# Altium project altium_giris.PrjPcb (part 2 of 3)

## Sheet Microcontroller.SchDoc: Wireless Security Detector
size A3; Engineer: Hamit; DocumentNumber: 3; SheetNumber: 3; SheetTotal: 4
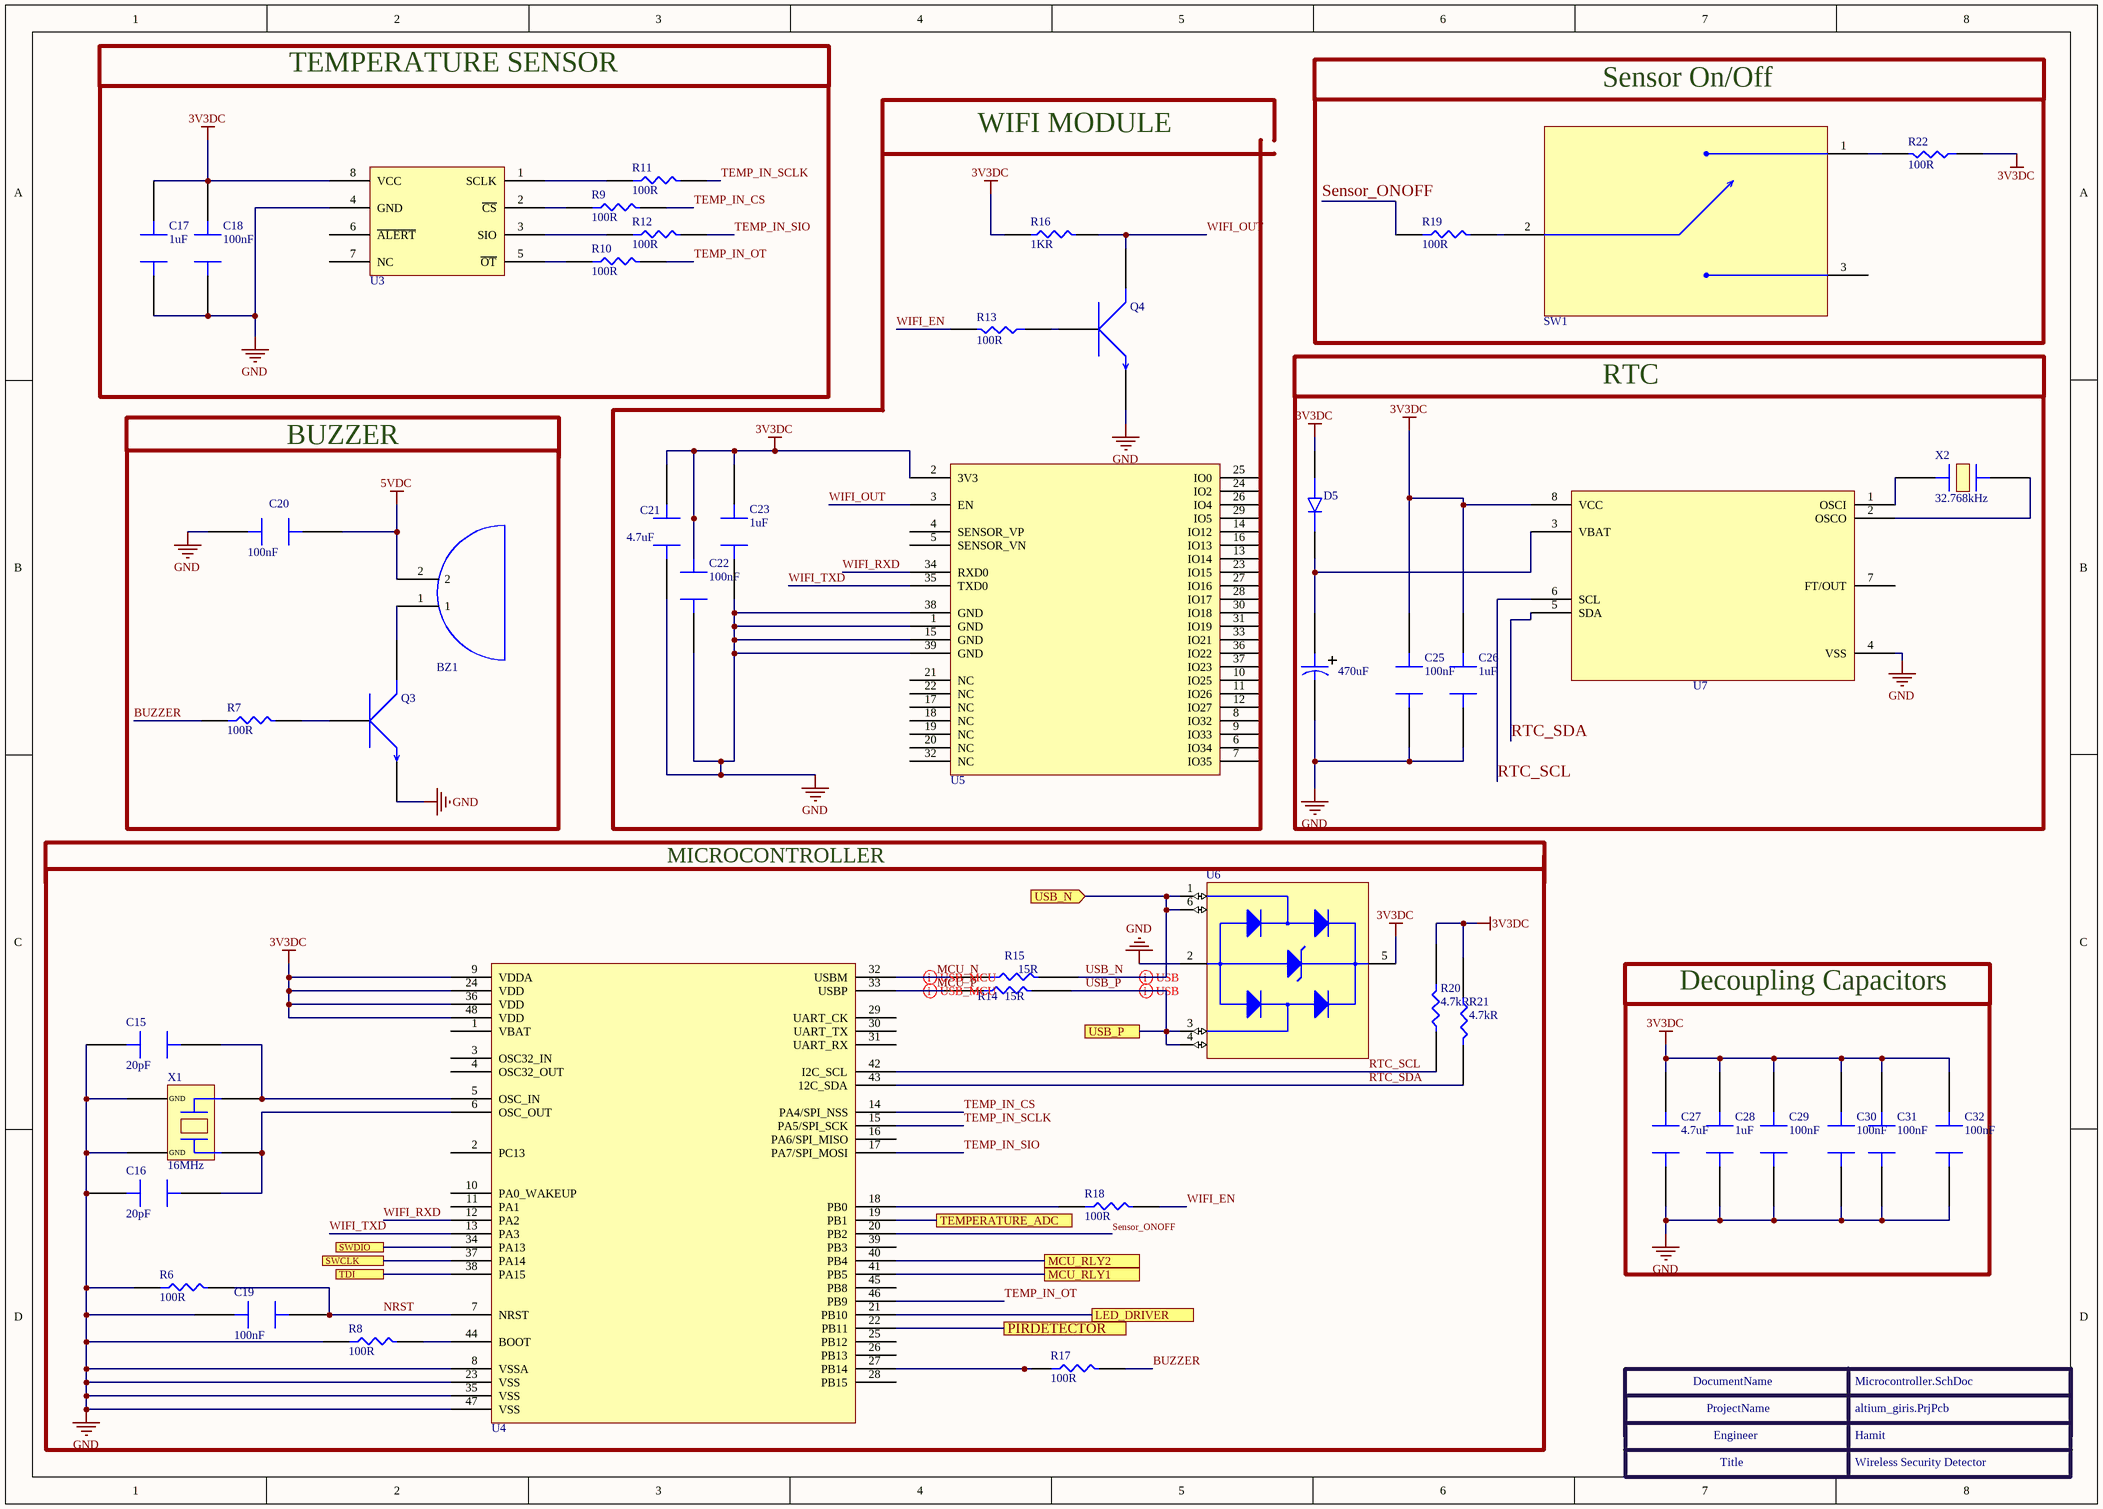
[diagram p5: Microcontroller.SchDoc]

### Parts
BZ1  CMI-9605IC-0580T  [CMI-9605IC-0580T]  (value not drawn)
C15  Capacitance: 20pF  [CAP_0603]  (hidden comment: CL10C200JB8NNNC)
C16  Capacitance: 20pF  [CAP_0603]  (hidden comment: CL10C200JB8NNNC)
C17  Capacitance: 1uF  [cap_0805]  (hidden comment: CAP CER 1uF 0805)
C18  Capacitance: 100nF  [cap_0805]  (hidden comment: CL21B104KBCNNNC)
C19  Capacitance: 100nF  [CAP_0603]  (hidden comment: CAP CER 100nF 0603)
C20  Capacitance: 100nF  [CAP_0603]  (hidden comment: CAP CER 100nF 0603)
C21  Capacitance: 4.7uF  [cap_0805]  (hidden comment: CL21A475KAQNNNE)
C22  Capacitance: 100nF  [cap_0805]  (hidden comment: CL21B104KBCNNNC)
C23  Capacitance: 1uF  [cap_0805]  (hidden comment: CAP CER 1uF 0805)
C24  Capacitance: 470uF  [cap_ESH477M050AH4AA]  (hidden comment: ESH477M050AH4AA)
C25  Capacitance: 100nF  [CAP_0603]  (hidden comment: CAP CER 100nF 0603)
C26  Capacitance: 1uF  [cap_0805]  (hidden comment: CAP CER 1uF 0805)
C27  Capacitance: 4.7uF  [cap_0805]  (hidden comment: CL21A475KAQNNNE)
C28  Capacitance: 1uF  [cap_0805]  (hidden comment: CAP CER 1uF 0805)
C29  Capacitance: 100nF  [CAP_0603]  (hidden comment: CAP CER 100nF 0603)
C30  Capacitance: 100nF  [CAP_0603]  (hidden comment: CAP CER 100nF 0603)
C31  Capacitance: 100nF  [CAP_0603]  (hidden comment: CAP CER 100nF 0603)
C32  Capacitance: 100nF  [CAP_0603]  (hidden comment: CAP CER 100nF 0603)
D5  DIODE GEN PURP 75V 150MA SOD323F  [1N4148WS]  (value not drawn)
Q3  MMBT3904-7-F  [SSM3K357R,LF]  (value not drawn)
Q4  MMBT3904-7-F  [SSM3K357R,LF]  (value not drawn)
R6  Resistance: 100R  [RES_0603]  (hidden comment: RC0603FR-7W100RL)
R7  Resistance: 100R  [RES_0603]  (hidden comment: RC0603FR-7W100RL)
R8  Resistance: 100R  [RES_0603]  (hidden comment: RC0603FR-7W100RL)
R9  Resistance: 100R  [RES_0603]  (hidden comment: RC0603FR-7W100RL)
R10  Resistance: 100R  [RES_0603]  (hidden comment: RC0603FR-7W100RL)
R11  Resistance: 100R  [RES_0603]  (hidden comment: RC0603FR-7W100RL)
R12  Resistance: 100R  [RES_0603]  (hidden comment: RC0603FR-7W100RL)
R13  Resistance: 100R  [RES_0603]  (hidden comment: RC0603FR-7W100RL)
R14  Resistance: 15R  [RES_0603]  (hidden comment: rc0603jr-0715rl)
R15  Resistance: 15R  [RES_0603]  (hidden comment: rc0603jr-0715rl)
R16  Resistance: 1KR  [RES_0603]  (hidden comment: RC0603FR-0710KL)
R17  Resistance: 100R  [RES_0603]  (hidden comment: RC0603FR-7W100RL)
R18  Resistance: 100R  [RES_0603]  (hidden comment: RC0603FR-7W100RL)
R19  Resistance: 100R  [RES_0603]  (hidden comment: RC0603FR-7W100RL)
R20  Resistance: 4.7kR  [RES_0603]  (hidden comment: RC0603JR-074K7L)
R21  Resistance: 4.7kR  [RES_0603]  (hidden comment: RC0603JR-074K7L)
R22  Resistance: 100R  [RES_0603]  (hidden comment: RC0603FR-7W100RL)
SW1  EG1215AA  [EG1215AA]  (value not drawn)
U3  MAX6662MSA+-ND  [LM2675MX-12/NOPB]  (value not drawn)
U4  STM32F103C6T7A  [LQFP-48]  (value not drawn)
U5  ESP32-WROOM-32E(4MB)  [ESP32-32]  (value not drawn)
U6  USBLC6-2SC6  [SOT23-6]  (value not drawn)
U7  M41T00M6F  [LM2675MX-12/NOPB]  (value not drawn)
X1  Frequency: 16MHz  [CRYSTAL_ECS-160-20-30B-TR]  (hidden comment: ECS-160-20-30B-TR)
X2  Frequency: 32.768kHz  [ABS05_crystal]  (hidden comment: ABS05-32.768KHZ-T)

### Blocks framed on the sheet
TEMPERATURE SENSOR: C17 C18 R9-R12 U3
Sensor On/Off: R19 R22 SW1
BUZZER: BZ1 C20 Q3 R7
RTC: C24-C26 D5 U7 X2
Decoupling Capacitors: C27-C32

### Ports
LED_DRIVER, MCU_RLY1, MCU_RLY2, PIRDETECTOR, SWCLK, SWDIO, TDI, TEMPERATURE_ADC, USB_N (in), USB_P

### Nets
3V3DC: C17.2 C18.2 C21.2 C22.2 C23.2 C25.2 C26.2 C27.2 C28.2 C29.2 C30.2 C31.2 C32.2 D5.A R16.2 R20.2 R21.1 R22.1 U3.8(VCC) U4.9(VDDA) U4.24(VDD) U4.36(VDD) U4.48(VDD) U5.2(3V3) U6.5(VBUS) U7.8(VCC)
5VDC: BZ1.2 C20.2
GND: C15.2 C16.2 C17.1 C18.1 C19.2 C20.1 C21.1 C22.1 C23.1 C24.2 C25.1 C26.1 C27.1 C28.1 C29.1 C30.1 C31.1 C32.1 Q3.2(E) Q4.2(E) R6.1 R8.1 U3.4(GND) U4.8(VSSA) U4.23(VSS) U4.35(VSS) U4.47(VSS) U5.1(GND) U5.15(GND) U5.38(GND) U5.39(GND) U6.2(GND) U7.4(VSS) X1.2(GND) X1.4(GND)
BUZZER: R7.1 R17.2
MCU_N: R15.1 U4.32(USBM)
MCU_P: R14.1 U4.33(USBP)
NRST: C19.1 R6.2 U4.7(NRST)
RTC_SCL: R20.1 U4.42(I2C_SCL) U7.6(SCL)
RTC_SDA: R21.2 U4.43(12C_SDA) U7.5(SDA)
Sensor_ONOFF: R19.1 U4.20(PB2)
TEMP_IN_CS: R9.2 U4.14(PA4/SPI_NSS)
TEMP_IN_OT: R10.2 U4.46(PB9)
TEMP_IN_SCLK: R11.2 U4.15(PA5/SPI_SCK)
TEMP_IN_SIO: R12.2 U4.17(PA7/SPI_MOSI)
USB_N: R15.2 U6.1(I/O1) U6.6(I/O1) ; port USB_N
USB_P: R14.2 U6.3(I/O2) U6.4(I/O2) ; port USB_P
WIFI_EN: R13.2 R18.2
WIFI_OUT: Q4.3(C) R16.1 U5.3(EN)
WIFI_RXD: U4.12(PA2) U5.34(RXD0)
WIFI_TXD: U4.13(PA3) U5.35(TXD0)
NetBZ1_1: BZ1.1 Q3.3(C)
NetC15_1: C15.1 U4.5(OSC_IN) X1.3
NetC16_1: C16.1 U4.6(OSC_OUT) X1.1
NetC24_1: C24.1 D5.C U7.3(VBAT)
NetJ5_3: U4.19(PB1) ; port TEMPERATURE_ADC
NetJ5_4: U4.21(PB10) ; port LED_DRIVER
NetJ5_5: U4.22(PB11) ; port PIRDETECTOR
NetJ7_2: U4.34(PA13) ; port SWDIO
NetJ7_3: U4.37(PA14) ; port SWCLK
NetJ7_4: U4.38(PA15) ; port TDI
NetQ3_1: Q3.1(B) R7.2
NetQ4_1: Q4.1(B) R13.1
NetR2_1: U4.41(PB5) ; port MCU_RLY1
NetR4_1: U4.40(PB4) ; port MCU_RLY2
NetR8_2: R8.2 U4.44(BOOT)
NetR9_1: R9.1 U3.2(~{CS})
NetR10_1: R10.1 U3.5(~{OT})
NetR11_1: R11.1 U3.1(SCLK)
NetR12_1: R12.1 U3.3(SIO)
NetR17_1: R17.1 U4.27(PB14)
NetR18_1: R18.1 U4.18(PB0)
NetR19_2: R19.2 SW1.2
NetR22_2: R22.2 SW1.1
NetU7_1: U7.1(OSCI) X2.1
NetU7_2: U7.2(OSCO) X2.2

Not connected (* = marked no-connect by the designer): SW1 3; U3 6(~{ALERT}) 7(NC); U4 1(VBAT) 2(PC13) 3(OSC32_IN) 4(OSC32_OUT) 10(PA0_WAKEUP) 11(PA1) 16(PA6/SPI_MISO) 25(PB12) 26(PB13) 28(PB15) 29(UART_CK) 30(UART_TX) 31(UART_RX) 39(PB3) 45(PB8); U5 4(SENSOR_VP) 5(SENSOR_VN) 6(IO34) 7(IO35) 8(IO32) 9(IO33) 10(IO25) 11(IO26) 12(IO27) 13(IO14) 14(IO12) 16(IO13) 17(NC) 18(NC) 19(NC) 20(NC) 21(NC) 22(NC) 23(IO15) 24(IO2) 25(IO0) 26(IO4) 27(IO16) 28(IO17) 29(IO5) 30(IO18) 31(IO19) 32(NC) 33(IO21) 36(IO22) 37(IO23); U7 7(FT/OUT)

### Layout directives
differential pair: MCU_N, MCU_P, USB_N, USB_P

### Notes on the sheet
- WIFI MODULE
- MICROCONTROLLER
- DocumentName
- ProjectName
- Engineer
- Title

### Library data of the parts
BZ1 = CMI-9605IC-0580T: Buzzers Indicator, Internally Driven Magnetic 30mA 2.7kHz 80dB @ 5V, 10cm Through Hole PC Pins; Manufacturer: CUI Devices; Designed by: Hamit; Supplier 1: Digi-Key; Manufacturer Part Number: CMI-9605IC-0580T; RoHS: No; Stock 1: 1402; Pricing 1: 1=1,56000, 10=1,17900, 25=1,09080, 50=1,02680, 100=0,96490, 500=0,83018, 1000=0,77805 (USD); Supplier Part Number 1: 2223-CMI-9605IC-0580T-ND
C15 C16 = CAP CER 20PF: SAMSUNG ELECTRO-MECHANICS - CL10C200JB8NNNC - SMD Multilayer Ceramic Capacitor, 20 pF, 50 V, 0603 [1608 Metric], ± 5%, C0G / NP0, CL Series; Voltage Rating: 50V; Temperature Coefficient: 300ppm/°C; Designed by: Hamit; Supplier 1: Digi-Key; Manufacturer: Samsung; Manufacturer Part Number: CL10C200JB8NNNC; RoHS: Yes; Category: Ceramic Capacitors; Stock 1: 540004; Pricing 1: 1=0,10000, 10=0,04900, 50=0,02680, 100=0,02180, 500=0,01558, 1000=0,01224 (USD); Mount: Surface Mount; Case/Package: 0603; Case Code (Metric): 1608; Case Code (Imperial): 0603; Min Operating Temperature: -55°C; Max Operating Temperature: 125°C; Tolerance: 5%; Dielectric: C0G; Package Quantity: 1; Packaging: Tape and Reel; Voltage: 50V; Series: CL; Construction: Flat; Length: 1.6mm; Width: 0.031inch; Height: 0.8mm; Thickness: 0.035inch; Depth: 0.8mm; Radiation Hardening: No; RoHS Compliant: Yes; ComponentLink1URL: https://datasheet.ciiva.com/26877/getdatasheetpartid-640634-26877974.pdf?src-supplier=Verical; ComponentLink1Description: https://datasheet.ciiva.com/26877/getdatasheetpartid-640634-26877974.pdf?src-supplier=Verical; ComponentLink2URL: https://datasheet.ciiva.com/26310/mlcc-catalogdownload2013-eng-26310315.pdf?src-supplier=Distrelec; ComponentLink2Description: https://datasheet.ciiva.com/26310/mlcc-catalogdownload2013-eng-26310315.pdf?src-supplier=Distrelec; Supplier Part Number 1: 1276-1187-1-ND
C17 C23 C26 C28 = CAP CER 1uF 0805: 0805 0.1 uF ±10 % Tolerance 50 V X7R Multilayer Ceramic Capacitors; Manufacturer: Samsung; Manufacturer Part Number: CL21B104KBFNNNE; Designed by: Hamit; Tolerance: 10%; Voltage Rating: 50V; Supplier 1: Digi-Key; RoHS: Yes; Category: Ceramic Capacitors; Pricing 1: 1=0,10000, 10=0,04900, 50=0,02700, 100=0,02200, 500=0,01574, 1000=0,01237 (USD); Mount: Surface Mount; Case/Package: 0805; Case Code (Metric): 2012; Case Code (Imperial): 0805; Contact Plating: Tin; Min Operating Temperature: -55°C; Max Operating Temperature: 125°C; Dielectric: X7R; Package Quantity: 1; Packaging: Tape and Reel; Voltage Rating (DC): 50V; Series: CL; Construction: Flat; Length: 2mm; Width: 0.049inch; Height: 1.25mm; Thickness: 0.053inch; Depth: 1.25mm; Radiation Hardening: No; Lead Free: Lead Free; RoHS Compliant: Yes; ComponentLink1URL: https://datasheet.ciiva.com/25736/cl21b104kbfnnne-25736721.pdf?src-supplier=Digi-Key; ComponentLink1Description: https://datasheet.ciiva.com/25736/cl21b104kbfnnne-25736721.pdf?src-supplier=Digi-Key; Supplier Part Number 1: 1276-1180-1-ND
C18 C22 = CAP cer 100nF 0805: Samsung Electro-Mechanics 100nF Multilayer Ceramic Capacitor (MLCC) 50 V 10% X7R dielectric CL max op. temp. +125C; Designed by: Hamit; Voltage Rating: 50V; Supplier 1: Digi-Key; Manufacturer: Samsung; Manufacturer Part Number: CL21B104KBCNNNC; RoHS: Yes; Category: Ceramic Capacitors; Pricing 1: 1=0,10000, 10=0,05000, 50=0,02740, 100=0,02240, 500=0,01598, 1000=0,01256 (USD); Mount: Surface Mount; Case/Package: 0805; Case Code (Metric): 2012; Case Code (Imperial): 0805; Material: Ceramic; Contact Plating: Tin; Min Operating Temperature: -55°C; Max Operating Temperature: 125°C; Tolerance: 10%; Dielectric: X7R; Packaging: Tape and Reel; Voltage: 50V; Voltage Rating (DC): 50V; Series: CL; Construction: Flat; Length: 2mm; Width: 0.049inch; Height: 0.85mm; Depth: 1.25mm; Thickness: 0.037inch; Radiation Hardening: No; Lead Free: Lead Free; RoHS Compliant: Yes; ComponentLink1URL: https://datasheet.ciiva.com/25710/cl21b104kbcnnnc-25710182.pdf?src-supplier=Digi-Key; ComponentLink1Description: https://datasheet.ciiva.com/25710/cl21b104kbcnnnc-25710182.pdf?src-supplier=Digi-Key; ComponentLink2URL: https://datasheet.ciiva.com/29199/454152-da-01-en-vs-kondensator-0805-29199814.pdf?src-supplier=Conrad; ComponentLink2Description: https://datasheet.ciiva.com/29199/454152-da-01-en-vs-kondensator-0805-29199814.pdf?src-supplier=Conrad; Supplier Part Number 1: 1276-1003-1-ND
C19 C20 C25 C29-C32 = CAP CER 100nF 0603: KEMET - C0603C104K5RACTU - SMD Multilayer Ceramic Capacitor, 0.1 µF, 50 V, 0603 [1608 Metric], ± 10%, X7R, C Series KEMET; Designed by: Hamit; Voltage Rating (DC): 50V; Dissipation Factor: 2.5%; Supplier 1: Digi-Key; Manufacturer: KEMET; Manufacturer Part Number: C0603C104K5RACTU; RoHS: Yes; Category: Ceramic Capacitors; Stock 1: 4486940; Pricing 1: 1=0,12000, 10=0,08900, 50=0,04840, 100=0,03940, 500=0,02818, 1000=0,02214 (USD); Mount: Surface Mount; Case/Package: 0603; Number of Pins: 2; Case Code (Metric): 1608; Case Code (Imperial): 0603; Dielectric Material: Ceramic; Contact Plating: Tin,Matte; Min Operating Temperature: -55°C; Max Operating Temperature: 125°C; Tolerance: 10%; Packaging: Tape and Reel; Package Quantity: 1; Dielectric: X7R; Termination: SMD/SMT; Voltage: 50V; Voltage Rating: 50V; Series: SMD Comm X7R; Length: 0.063inch; Width: 0.031inch; Height: 0.8mm; Thickness: 0.034inch; Lead Pitch: 0.7mm; Depth: 0.8mm; Radiation Hardening: No; RoHS Compliant: Yes; REACH SVHC: No SVHC; ComponentLink1URL: https://datasheet.ciiva.com/7823/kem-c1002-x7r-smd-7823591.pdf?src-supplier=Element14; ComponentLink1Description: https://datasheet.ciiva.com/7823/kem-c1002-x7r-smd-7823591.pdf?src-supplier=Element14; ComponentLink2URL: https://datasheet.ciiva.com/14602/70095383-14602583.pdf?src-supplier=Allied+Electronics; ComponentLink2Description: https://datasheet.ciiva.com/14602/70095383-14602583.pdf?src-supplier=Allied+Electronics; ComponentLink3URL: https://datasheet.ciiva.com/5999/kem-c1002-x7r-smd-5999400.pdf?src-supplier=Farnell; ComponentLink3Description: https://datasheet.ciiva.com/5999/kem-c1002-x7r-smd-5999400.pdf?src-supplier=Farnell; ComponentLink4URL: https://datasheet.ciiva.com/7823/kem-c1002-x7r-smd-7823592.pdf?src-supplier=Element14; ComponentLink4Description: https://datasheet.ciiva.com/7823/kem-c1002-x7r-smd-7823592.pdf?src-supplier=Element14; ComponentLink5URL: https://datasheet.ciiva.com/28645/1851736-28645640.pdf?src-supplier=Element14; ComponentLink5Description: https://datasheet.ciiva.com/28645/1851736-28645640.pdf?src-supplier=Element14; ComponentLink6URL: https://datasheet.ciiva.com/14585/70095383-14585209.pdf?src-supplier=Allied+Electronics; ComponentLink6Description: https://datasheet.ciiva.com/14585/70095383-14585209.pdf?src-supplier=Allied+Electronics; Supplier Part Number 1: 399-5089-6-ND
C21 = cap_0805_4.7uF: SAMSUNG ELECTRO-MECHANICS - CL21A475KAQNNNE - SMD Multilayer Ceramic Capacitor, 4.7 µF, 25 V, 0805 [2012 Metric], ± 10%, X5R, CL Series; Voltage Rating: 25V; Designed by: Hamit; Supplier 1: Mouser; Manufacturer: Samsung; Manufacturer Part Number: CL21A475KAQNNNE; RoHS: Yes; Category: Ceramic Capacitors; Stock 1: 975; Pricing 1: 1=0,12000, 10=0,04800, 50=0,04800, 100=0,03900, 500=0,02800, 1000=0,02300, 2000=0,02000, 10000=0,02000 (USD); Mount: Surface Mount; Case/Package: 0805; Case Code (Metric): 2012; Case Code (Imperial): 0805; Min Operating Temperature: -55°C; Max Operating Temperature: 85°C; Package Quantity: 1; Packaging: Tape and Reel; Tolerance: 10%; Dielectric: X5R; Voltage Rating (DC): 25V; Series: CL; Construction: Flat; Length: 2mm; Width: 0.049inch; Height: 1.25mm; Thickness: 0.055inch; Depth: 1.25mm; Radiation Hardening: No; Lead Free: Lead Free; RoHS Compliant: Yes; ComponentLink1URL: https://datasheet.ciiva.com/25798/cl21a475kaqnnne-25798882.pdf?src-supplier=Digi-Key; ComponentLink1Description: https://datasheet.ciiva.com/25798/cl21a475kaqnnne-25798882.pdf?src-supplier=Digi-Key; Supplier Part Number 1: 187-CL21A475KAQNNNE
C24 = CAP ALU 470uF: Cap, 470UF, 50V, Alu Elec, Radial; Manufacturer: KEMET; Designed by: Hamit; Polarity: Polar; Tolerance: 20%; Life (Hours): 2000Hour; Supplier 1: Digi-Key; Manufacturer Part Number: ESH477M050AH4AA; RoHS: Yes; Pricing 1: 1=0,59000, 10=0,41700, 50=0,31540, 100=0,27470, 500=0,20350, 1000=0,17298, 2500=0,16280, 5000=0,15262 (USD); Mount: Through Hole; Case/Package: Radial; Min Operating Temperature: -40°C; Max Operating Temperature: 105°C; Packaging: Bulk; Voltage Rating: 50V; RoHS Compliant: No; ComponentLink1URL: https://api.kemet.com/component-edge/download/datasheet/ESH477M050AH4AA.pdf?src-supplier=Digi-Key; ComponentLink1Description: https://api.kemet.com/component-edge/download/datasheet/ESH477M050AH4AA.pdf?src-supplier=Digi-Key; Supplier Part Number 1: 399-15683-ND
C27 = CAP CER 4.7 uF: SAMSUNG ELECTRO-MECHANICS - CL21A475KAQNNNE - SMD Multilayer Ceramic Capacitor, 4.7 µF, 25 V, 0805 [2012 Metric], ± 10%, X5R, CL Series; Voltage Rating: 25V; Designed by: Hamit; Supplier 1: Digi-Key; Manufacturer: Samsung; Manufacturer Part Number: CL21A475KAQNNNE; RoHS: Yes; Category: Ceramic Capacitors; Pricing 1: 1=0,12000, 10=0,08300, 50=0,04700, 100=0,03890, 500=0,02728, 1000=0,02259 (USD); Mount: Surface Mount; Case/Package: 0805; Case Code (Metric): 2012; Case Code (Imperial): 0805; Min Operating Temperature: -55°C; Max Operating Temperature: 85°C; Package Quantity: 1; Packaging: Tape and Reel; Tolerance: 10%; Dielectric: X5R; Voltage Rating (DC): 25V; Series: CL; Construction: Flat; Length: 2mm; Width: 0.049inch; Height: 1.25mm; Thickness: 0.055inch; Depth: 1.25mm; Radiation Hardening: No; Lead Free: Lead Free; RoHS Compliant: Yes; ComponentLink1URL: https://datasheet.ciiva.com/25798/cl21a475kaqnnne-25798882.pdf?src-supplier=Digi-Key; ComponentLink1Description: https://datasheet.ciiva.com/25798/cl21a475kaqnnne-25798882.pdf?src-supplier=Digi-Key; Supplier Part Number 1: 1276-1244-1-ND
D5 = 1N4148WS: ON SEMICONDUCTOR - 1N4148WS - Small Signal Diode, Single, 75 V, 150 mA, 1 V, 4 ns; Manufacturer: ON Semiconductor / Fairchild; Designed by: Hamit; Reverse Recovery Time: 4ns; Forward Voltage: 1V; Max Reverse Current: 5uA; Power Dissipation: 200mW; Max Forward Surge Current (Ifsm): 2A; Supplier 1: Digi-Key; Manufacturer Part Number: 1N4148WS; RoHS: Yes; Category: Rectifier Diodes; Pricing 1: 1=0,21000, 10=0,19200, 100=0,10460, 500=0,06436, 1000=0,04388 (USD); Mount: Surface Mount; Number of Pins: 2; Contact Plating: Tin,Matte; Weight: 0.0276g; Min Operating Temperature: -55°C; Max Operating Temperature: 150°C; Packaging: Tape and Reel; Forward Current: 150mA; Max Repetitive Reverse Voltage (Vrrm): 75V; Element Configuration: Single; Package Quantity: 1; Average Rectified Current: 150mA; Max Reverse Voltage (DC): 75V; Recovery Time: 4ns; Series: -; Reverse Voltage: 75V; Length: 1.8mm; Width: 1.35mm; Height: 1mm; Radiation Hardening: No; RoHS Compliant: Yes; REACH SVHC: No SVHC; Lead Free: Lead Free; ComponentLink1URL: https://datasheet.ciiva.com/25968/1n914bws-25968945.pdf?src-supplier=Avnet+Europe; ComponentLink1Description: https://datasheet.ciiva.com/25968/1n914bws-25968945.pdf?src-supplier=Avnet+Europe; ComponentLink2URL: https://datasheet.ciiva.com/30479/0900766b810e1cd3-30479206.pdf?src-supplier=RSComponents; ComponentLink2Description: https://datasheet.ciiva.com/30479/0900766b810e1cd3-30479206.pdf?src-supplier=RSComponents; ComponentLink3URL: https://datasheet.ciiva.com/8300/1n914bws-8300360.pdf?src-supplier=Avnet; ComponentLink3Description: https://datasheet.ciiva.com/8300/1n914bws-8300360.pdf?src-supplier=Avnet; ComponentLink4URL: https://datasheet.ciiva.com/15208/getdatasheetpartid-127819-15208358.pdf?src-supplier=Verical; ComponentLink4Description: https://datasheet.ciiva.com/15208/getdatasheetpartid-127819-15208358.pdf?src-supplier=Verical; ComponentLink5URL: https://datasheet.ciiva.com/910/1n4148ws-910381.pdf?src-supplier=Digi-Key; ComponentLink5Description: https://datasheet.ciiva.com/910/1n4148ws-910381.pdf?src-supplier=Digi-Key; ComponentLink6URL: https://datasheet.ciiva.com/910/1n4148ws-910382.pdf?src-supplier=Digi-Key; ComponentLink6Description: https://datasheet.ciiva.com/910/1n4148ws-910382.pdf?src-supplier=Digi-Key; ComponentLink7URL: https://datasheet.ciiva.com/910/1n4148ws-910380.pdf?src-supplier=Digi-Key; ComponentLink7Description: https://datasheet.ciiva.com/910/1n4148ws-910380.pdf?src-supplier=Digi-Key; Supplier Part Number 1: 1N4148WSFSCT-ND
Q3 Q4 = MMBT3904-7-F: Transistor General Purpose BJT NPN 40 Volt 0.2A Automotive 3-Pin SOT-23; Manufacturer: Diodes Zetex; Designed by: Hamit; Max Power Dissipation: 300mW; Collector Emitter Voltage (VCEO): 40V; Max Collector Current: 200mA; Collector Base Voltage (VCBO): 60V; Frequency: 300MHz; hFE Min: 100; Number of Elements: 1; Emitter Base Voltage (VEBO): 6V; Collector Emitter Saturation Voltage: 300mV; Power Dissipation: 350mW; Element Configuration: Single; Supplier 1: Digi-Key; Manufacturer Part Number: MMBT3904-7-F; RoHS: Yes; Category: BJTs; Pricing 1: 1=0,12000, 10=0,11100, 25=0,10600, 100=0,06060, 500=0,03732, 1000=0,02544 (USD); Mount: Surface Mount; Case/Package: SOT-23; Number of Pins: 3; Weight: 0.000282oz; Contact Plating: Tin,Matte; Min Operating Temperature: -55°C; Max Operating Temperature: 150°C; Polarity: NPN; Packaging: Tape and Reel; Package Quantity: 3000; Transition Frequency: 300MHz; Collector Emitter Breakdown Voltage: 40V; Max Breakdown Voltage: 40V; Continuous Collector Current: 200mA; Max Frequency: 300MHz; Gain Bandwidth Product: 300MHz; Series: -; Collector-emitter Voltage-Max: 300mV; Voltage Rating (DC): 40V; Length: 3.05mm; Width: 1.4mm; Height: 1mm; Radiation Hardening: No; REACH SVHC: No SVHC; Lead Free: Lead Free; RoHS Compliant: Yes; ComponentLink1URL: https://datasheet.ciiva.com/11201/ds30036-11201778.pdf?src-supplier=Avnet; ComponentLink1Description: https://datasheet.ciiva.com/11201/ds30036-11201778.pdf?src-supplier=Avnet; ComponentLink2URL: https://datasheet.ciiva.com/15138/getdatasheetpartid-53265-15138780.pdf?src-supplier=Verical; ComponentLink2Description: https://datasheet.ciiva.com/15138/getdatasheetpartid-53265-15138780.pdf?src-supplier=Verical; ComponentLink3URL: https://datasheet.ciiva.com/6361/ds30036-6361254.pdf?src-supplier=Digi-Key; ComponentLink3Description: https://datasheet.ciiva.com/6361/ds30036-6361254.pdf?src-supplier=Digi-Key; ComponentLink4URL: https://datasheet.ciiva.com/22711/1915516-22711750.pdf?src-supplier=Element14; ComponentLink4Description: https://datasheet.ciiva.com/22711/1915516-22711750.pdf?src-supplier=Element14; ComponentLink5URL: https://datasheet.ciiva.com/11198/ds30036-11198999.pdf?src-supplier=Avnet; ComponentLink5Description: https://datasheet.ciiva.com/11198/ds30036-11198999.pdf?src-supplier=Avnet; ComponentLink6URL: https://datasheet.ciiva.com/6361/ds30036-6361256.pdf?src-supplier=Digi-Key; ComponentLink6Description: https://datasheet.ciiva.com/6361/ds30036-6361256.pdf?src-supplier=Digi-Key; Supplier Part Number 1: MMBT3904-FDICT-ND
R6 R8 R13 = RES 100 OHm: RESISTOR, 0603, 100R, 1%; Manufacturer: Yageo; Voltage Rating: 50V; Power Rating: 100mW; Temperature Coefficient: 100ppm/°C; Supplier 1: Digi-Key; Manufacturer Part Number: RC0603FR-7W100RL; RoHS: Yes; Category: Chip SMD Resistors; Stock 1: 137; Pricing 1: 1=0,10000, 10=0,03600, 100=0,01450, 1000=0,00652, 2500=0,00566 (USD); Case/Package: 0603; Number of Pins: 2; Case Code (Metric): 1608; Case Code (Imperial): 0603; Packaging: Cut Tape; Tolerance: 1%; Resistor Type: Thick Film; Voltage Rating (DC): 50V; Resistance Tolerance: 1%; Series: RC0603; REACH SVHC: Unknown; RoHS Compliant: Yes; ComponentLink1URL: https://datasheet.ciiva.com/22704/1675737-22704044.pdf?src-supplier=Element14; ComponentLink1Description: https://datasheet.ciiva.com/22704/1675737-22704044.pdf?src-supplier=Element14; ComponentLink2URL: https://datasheet.ciiva.com/7746/1675737-7746414.pdf?src-supplier=Element14; ComponentLink2Description: https://datasheet.ciiva.com/7746/1675737-7746414.pdf?src-supplier=Element14; Supplier Part Number 1: 13-RC0603FR-7W100RLCT-ND
R7 R9-R12 R17-R19 R22 = RES 100 OHM: RESISTOR, 0603, 100R, 1%; Manufacturer: Yageo; Voltage Rating: 50V; Power Rating: 100mW; Temperature Coefficient: 100ppm/°C; Supplier 1: Digi-Key; Manufacturer Part Number: RC0603FR-7W100RL; RoHS: Yes; Category: Chip SMD Resistors; Stock 1: 137; Pricing 1: 1=0,10000, 10=0,03600, 100=0,01450, 1000=0,00652, 2500=0,00566 (USD); Case/Package: 0603; Number of Pins: 2; Case Code (Metric): 1608; Case Code (Imperial): 0603; Packaging: Cut Tape; Tolerance: 1%; Resistor Type: Thick Film; Voltage Rating (DC): 50V; Resistance Tolerance: 1%; Series: RC0603; REACH SVHC: Unknown; RoHS Compliant: Yes; ComponentLink1URL: https://datasheet.ciiva.com/22704/1675737-22704044.pdf?src-supplier=Element14; ComponentLink1Description: https://datasheet.ciiva.com/22704/1675737-22704044.pdf?src-supplier=Element14; ComponentLink2URL: https://datasheet.ciiva.com/7746/1675737-7746414.pdf?src-supplier=Element14; ComponentLink2Description: https://datasheet.ciiva.com/7746/1675737-7746414.pdf?src-supplier=Element14; Supplier Part Number 1: 13-RC0603FR-7W100RLCT-ND
R14 R15 = RES 15 OHM 0603: YAGEO - RC0603JR-0715RL - SMD Chip Resistor, 0603 [1608 Metric], 15 ohm, RC Series, 75 V, Thick Film, 100 mW; Designed by: Hamit; Tolerance: 5%; Temperature Coefficient: 100ppm/°C; Voltage Rating (DC): 50V; Power Rating: 100mW; Voltage Rating: 75V; Supplier 1: Digi-Key; Manufacturer: Yageo; Manufacturer Part Number: RC0603JR-0715RL; RoHS: Yes; Category: Chip SMD Resistors; Stock 1: 471705; Pricing 1: 1=0,10000, 10=0,02000, 100=0,00800, 1000=0,00360, 2500=0,00312 (USD); Case/Package: 0603; Number of Pins: 2; Case Code (Imperial): 0603; Case Code (Metric): 1608; Weight: 7.1E-05oz; Min Operating Temperature: -55°C; Max Operating Temperature: 155°C; Resistor Type: Thick Film; Packaging: Tape and Reel; Package Quantity: 1; Termination: SMD/SMT; Number of Terminations: 2; Max Power Dissipation: 100mW; Working Voltage: 75V; Features: Moisture Resistant; Series: RC; Resistance Tolerance: 5%; Construction: Rectangular; Length: 1.6mm; Width: 0.8mm; Height: 0.022inch; Depth: 0.8mm; REACH SVHC: No SVHC; Lead Free: Lead Free; Military Standard: Not; RoHS Compliant: Yes; ComponentLink1URL: https://datasheet.ciiva.com/2453/pyu-r-int-thick-7-2453085.pdf?src-supplier=Digi-Key; ComponentLink1Description: https://datasheet.ciiva.com/2453/pyu-r-int-thick-7-2453085.pdf?src-supplier=Digi-Key; ComponentLink2URL: https://datasheet.ciiva.com/7746/443971-7746445.pdf?src-supplier=Element14; ComponentLink2Description: https://datasheet.ciiva.com/7746/443971-7746445.pdf?src-supplier=Element14; ComponentLink3URL: https://datasheet.ciiva.com/2453/pyu-r-int-thick-7-2453086.pdf?src-supplier=Digi-Key; ComponentLink3Description: https://datasheet.ciiva.com/2453/pyu-r-int-thick-7-2453086.pdf?src-supplier=Digi-Key; ComponentLink4URL: https://datasheet.ciiva.com/7746/443971-7746446.pdf?src-supplier=Element14; ComponentLink4Description: https://datasheet.ciiva.com/7746/443971-7746446.pdf?src-supplier=Element14; ComponentLink5URL: https://datasheet.ciiva.com/2453/pyu-r-int-thick-7-2453087.pdf?src-supplier=Digi-Key; ComponentLink5Description: https://datasheet.ciiva.com/2453/pyu-r-int-thick-7-2453087.pdf?src-supplier=Digi-Key; Supplier Part Number 1: 311-15GRCT-ND
R16 = RES 1K OHM 0603: RES 1K %1 OHM 0603 SMD; Manufacturer: Yageo; Manufacturer Part Number: RC0603JR-071KL; Designed by: Hamit; Tolerance: 5%; Temperature Coefficient: 100ppm/°C; Voltage Rating (DC): 50V; Power Rating: 100mW; Body Length: 1.6mm; Supplier 1: Digi-Key; RoHS: Yes; Category: Chip SMD Resistors; Stock 1: 5112056; Pricing 1: 1=0,10000, 10=0,01900, 100=0,00770, 1000=0,00344, 2500=0,00298 (USD); Case/Package: 0603; Number of Pins: 2; Contact Plating: Tin,Matte; Case Code (Imperial): 0603; Case Code (Metric): 1608; Size Code: 0603; Min Operating Temperature: -55°C; Max Operating Temperature: 155°C; Resistor Type: Thick Film; Packaging: Tape and Reel; Package Quantity: 5000; Voltage Rating: 50V; Termination: SMD/SMT; Series: RC; Resistance Tolerance: 5%; Construction: Rectangular; Length: 1.6mm; Width: 0.8mm; Height: 0.45mm; Depth: 0.8mm; Radiation Hardening: No; REACH SVHC: Unknown; Lead Free: Lead Free; Military Standard: Not; RoHS Compliant: Yes; ComponentLink1URL: https://datasheet.ciiva.com/8883/pyu-rc0603-51-rohs-l-4-8883051.pdf?src-supplier=Avnet; ComponentLink1Description: https://datasheet.ciiva.com/8883/pyu-rc0603-51-rohs-l-4-8883051.pdf?src-supplier=Avnet; ComponentLink2URL: https://datasheet.ciiva.com/7746/443971-7746461.pdf?src-supplier=Element14; ComponentLink2Description: https://datasheet.ciiva.com/7746/443971-7746461.pdf?src-supplier=Element14; ComponentLink3URL: https://datasheet.ciiva.com/22747/443971-22747533.pdf?src-supplier=Element14; ComponentLink3Description: https://datasheet.ciiva.com/22747/443971-22747533.pdf?src-supplier=Element14; ComponentLink4URL: https://datasheet.ciiva.com/7746/443971-7746462.pdf?src-supplier=Element14; ComponentLink4Description: https://datasheet.ciiva.com/7746/443971-7746462.pdf?src-supplier=Element14; Supplier Part Number 1: 311-1.0KGRCT-ND
R20 R21 = RES 4K7 OHM: Res Thick Film 0603 4.7K Ohm 5% 0.1W(1/10W) ±100ppm/C Molded SMD Paper T/R; Manufacturer: Yageo; Designed by: Hamit; Temperature Coefficient: 100ppm/°C; Voltage Rating (DC): 50V; Power Rating: 100mW; Supplier 1: Digi-Key; Manufacturer Part Number: RC0603JR-074K7L; RoHS: Yes; Category: Chip SMD Resistors; Stock 1: 321494; Pricing 1: 1=0,10000, 10=0,02000, 100=0,00800, 1000=0,00360, 2500=0,00312 (USD); Case/Package: 0603; Number of Pins: 2; Case Code (Imperial): 0603; Case Code (Metric): 1608; Size Code: 0603; Min Operating Temperature: -55°C; Max Operating Temperature: 155°C; Resistor Type: Thick Film; Tolerance: 5%; Packaging: Tape and Reel; Voltage Rating: 50V; Termination: SMD/SMT; Features: Moisture Resistant; Max Power Dissipation: 100mW; Number of Terminations: 2; Series: RC; Resistance Tolerance: 5%; Construction: Rectangular; Length: 1.6mm; Width: 0.8mm; Depth: 0.8mm; REACH SVHC: No SVHC; Lead Free: Lead Free; RoHS Compliant: Yes; Military Standard: Not; ComponentLink1URL: https://datasheet.ciiva.com/46412/443971-46412858.pdf?src-supplier=Element14; ComponentLink1Description: https://datasheet.ciiva.com/46412/443971-46412858.pdf?src-supplier=Element14; Supplier Part Number 1: 311-4.7KGRCT-ND
SW1 = EG1215AA: Slide Switch, SPDT, 0.025A, 24V, SMD; Manufacturer: E-Switch; Designed by: Hamit; Mechanical Life: 10000Cycles; Switch Function: On-On; Current Rating: 25mA; Actuator Type: Standard; Switch Travel: 1.5mm; Operating Force: 150gf; Zener Voltage: 9.1V; Tolerance: 4.95%; Max Power Dissipation: 5W; Impedance: 2R; Actuator Length: 1.4mm; Supplier 1: Digi-Key; Manufacturer Part Number: EG1215AA; RoHS: Yes; Stock 1: 7580; Pricing 1: 1=0,99000, 10=0,95100, 25=0,88840, 100=0,77150, 250=0,70200, 500=0,65080, 1000=0,60327 (USD); Mount: Surface Mount,Through Hole; Case/Package: Axial; Min Operating Temperature: -20°C; Max Operating Temperature: 175°C; Throw Configuration: SPDT; Packaging: Cut Tape; Voltage Rating (DC): 24V; Termination: Gull Wing; Electrical Life: 10000Cycles; ComponentLink1URL: https://media.digikey.com/pdf/Data%20Sheets/E-Switch%20PDFs/EG1215_Series_Ds.pdf?src-supplier=Digi-Key; ComponentLink1Description: https://media.digikey.com/pdf/Data%20Sheets/E-Switch%20PDFs/EG1215_Series_Ds.pdf?src-supplier=Digi-Key; ComponentLink2URL: http://www.farnell.com/datasheets/2645007.pdf?src-supplier=Farnell; ComponentLink2Description: http://www.farnell.com/datasheets/2645007.pdf?src-supplier=Farnell; Supplier Part Number 1: EG5720CT-ND
U3 = MAX6662MSA+-ND: Temp Sensor Digital Serial (3-Wire, SPI) 8-Pin SOIC N Tube; Manufacturer: Maxim; Designed by: Hamit; Max Supply Voltage: 5.5V; Min Supply Voltage: 3V; Max Power Dissipation: 471mW; Resolution: 12b; Operating Supply Current: 600uA; Number of Bits: 12; Output Type: Digital,SPI; Supplier 1: Digi-Key; Manufacturer Part Number: MAX6662MSA+; RoHS: Yes; Category: Temperature and Humidity Sensors; Stock 1: 749; Pricing 1: 1=3,20000, 10=2,87000, 25=2,71360, 100=2,35170, 500=2,00196, 1000=1,78220 (USD); Case/Package: SOIC; Number of Pins: 8; Min Operating Temperature: -55°C; Max Operating Temperature: 150°C; Packaging: Rail/Tube; Package Quantity: 100; Interface: SPI; Max Supply Voltage (DC): 5.5V; Min Supply Voltage (DC): 3V; Series: MAX6662; Length: 5mm; Width: 4mm; Height: 1.5mm; Radiation Hardening: No; REACH SVHC: Unknown; Lead Free: Lead Free; RoHS Compliant: Yes; ComponentLink1URL: https://datasheet.ciiva.com/5299/max6662-89142-5299456.pdf?src-supplier=Mouser; ComponentLink1Description: https://datasheet.ciiva.com/5299/max6662-89142-5299456.pdf?src-supplier=Mouser; ComponentLink2URL: https://datasheet.ciiva.com/16635/max6662-16635842.pdf?src-supplier=Avnet+Europe; ComponentLink2Description: https://datasheet.ciiva.com/16635/max6662-16635842.pdf?src-supplier=Avnet+Europe; ComponentLink3URL: https://datasheet.ciiva.com/3277/max6662-3277979.pdf?src-supplier=Avnet; ComponentLink3Description: https://datasheet.ciiva.com/3277/max6662-3277979.pdf?src-supplier=Avnet; ComponentLink4URL: https://datasheet.ciiva.com/2003/max6662-2003390.pdf?src-supplier=Digi-Key; ComponentLink4Description: https://datasheet.ciiva.com/2003/max6662-2003390.pdf?src-supplier=Digi-Key; Supplier Part Number 1: MAX6662MSA+-ND
U4 = STM32F103C6T7A: IC MCU 32BIT 32KB FLASH 48LQFP; Manufacturer: STMicroelectronics; Number of I/Os: 37; Interface: I2C,SPI,USART,USB,CAN,IrDA,UART,LIN; RAM Size: 10KB; Number of Timers/Counters: 3; Max Power Dissipation: 363mW; Frequency: 72MHz; Min Supply Voltage: 2V; Data Bus Width: 32b; Oscillator Type: Internal; Watchdog Timer: Yes; Peripherals: POR,PWM,WDT,DMA,Temp Sensor; Core Architecture: ARM; Max Supply Voltage: 3.6V; Number of ADC Channels: 10; Number of SPI Channels: 1; designed by: Hamit; Supplier 1: Digi-Key; Manufacturer Part Number: STM32F103C6T7A; RoHS: Yes; Category: Microcontrollers; Pricing 1: 1=6,08000, 10=5,45600, 25=5,15840, 80=4,47063, 250=4,24132, 500=3,82100 (USD); Case/Package: LQFP; Number of Pins: 48; Min Operating Temperature: -40°C; Max Operating Temperature: 105°C; Package Quantity: 250; Packaging: Tray; Number of Programmable I/O: 37; Max Frequency: 72MHz; Memory Type: FLASH; Memory Size: 32KB; Number of I2C Channels: 1; Series: STM32 F1; Length: 7mm; Width: 7.2mm; Height: 1.45mm; Radiation Hardening: No; REACH SVHC: No SVHC; Lead Free: Lead Free; RoHS Compliant: Yes; ComponentLink1URL: https://datasheet.ciiva.com/15223/getdatasheetpartid-139036-15223558.pdf?src-supplier=Verical; ComponentLink1Description: https://datasheet.ciiva.com/15223/getdatasheetpartid-139036-15223558.pdf?src-supplier=Verical; ComponentLink2URL: https://datasheet.ciiva.com/8054/1717980-8054938.pdf?src-supplier=Element14; ComponentLink2Description: https://datasheet.ciiva.com/8054/1717980-8054938.pdf?src-supplier=Element14; Supplier 2: RSComponents; Stock 2: 1; Pricing 2: 1=5,53800, 10=5,27200, 25=4,97800, 50=4,69900 (USD); Supplier Part Number 2: 7238980P; Supplier Part Number 1: 497-11516-ND
U5 = ESP32-WROOM-32E(4MB): Bluetooth, WiFi 802.11b/g/n, Bluetooth v4.2 +EDR, Class 1, 2 and 3 Transceiver Module 2.4GHz ~ 2.5GHz Integrated, Trace Surface Mount; Manufacturer: Espressif Systems; Designed by: Hamit; Supply Voltage-Nom: 3.3V; Supplier 1: Digi-Key; Manufacturer Part Number: ESP32-WROOM-32E(4MB); RoHS: No; Pricing 1: 1=3,000000 (USD); Supplier Part Number 1: 1965-ESP32-WROOM-32E(4MB)CT-ND; Min Operating Temperature: -40°C; Max Operating Temperature: 85°C; ComponentLink1Description: DataSheet; ComponentLink1URL: chrome-extension://efaidnbmnnnibpcajpcglclefindmkaj/viewer.html?pdfurl=https%3A%2F%2Fwww.espressif.com%2Fsites%2Fdefault%2Ffiles%2Fdocumentation%2Fesp32-wroom-32e_esp32-wroom-32ue_datasheet_en.pdf&clen=749272&chunk=true
U6 = USB PROTECTION: TVS DIODE 5.25V 17V SOT23-6; Manufacturer: STMicroelectronics; Designed by: Hamit; Direction: Unidirectional,Bidirectional; Capacitance: 3.5pF; Operating Supply Voltage: 1.1V; Number of Channels: 2; Breakdown Voltage: 6V; Power Line Protection: Yes; Test Current: 1mA; Max Reverse Leakage Current: 150nA; Peak Pulse Current: 5A; Element Configuration: Dual; Data Rate: 480Mbps; Number of Elements: 1; Working Voltage: 5V; Supplier 1: Digi-Key; Manufacturer Part Number: USBLC6-2SC6; RoHS: Yes; Category: TVS Diodes; Pricing 1: 1=0,52000, 10=0,44800, 100=0,33450, 500=0,26282, 1000=0,20308 (USD); Mount: Surface Mount; Case/Package: SOT-23; Number of Pins: 6; Contact Plating: Tin,Matte; Min Operating Temperature: -40°C; Max Operating Temperature: 125°C; Clamping Voltage: 17V; Packaging: Tape and Reel; Package Quantity: 3000; Termination: SMD/SMT; Number of Bidirectional Channels: 2; Reverse Standoff Voltage: 5.25V; Min Breakdown Voltage: 6V; ESD Protection: Yes; Leakage Current: 150nA; Series: USB; Reverse Breakdown Voltage: 6V; Polarity: Unidirectional,Bidirectional; Max Breakdown Voltage: 6V; Clamping Voltage-Max: 17V; Length: 3.05mm; Width: 1.75mm; Height: 1.3mm; Depth: 1.75mm; Radiation Hardening: No; REACH SVHC: No SVHC; Lead Free: Lead Free; RoHS Compliant: Yes; ComponentLink1URL: https://datasheet.ciiva.com/1268/1690354-1268384.pdf?src-supplier=Element14; ComponentLink1Description: https://datasheet.ciiva.com/1268/1690354-1268384.pdf?src-supplier=Element14; ComponentLink2URL: https://datasheet.ciiva.com/4508/cd00050750-113117-4508433.pdf?src-supplier=Mouser; ComponentLink2Description: https://datasheet.ciiva.com/4508/cd00050750-113117-4508433.pdf?src-supplier=Mouser; ComponentLink3URL: https://datasheet.ciiva.com/15143/getdatasheetpartid-148465-15143789.pdf?src-supplier=Verical; ComponentLink3Description: https://datasheet.ciiva.com/15143/getdatasheetpartid-148465-15143789.pdf?src-supplier=Verical; ComponentLink4URL: https://datasheet.ciiva.com/26787/usblc6-2sc6-26787908.pdf?src-supplier=IIIC; ComponentLink4Description: https://datasheet.ciiva.com/26787/usblc6-2sc6-26787908.pdf?src-supplier=IIIC; ComponentLink5URL: https://datasheet.ciiva.com/16200/cd00050750-16200026.pdf?src-supplier=Future+Electronics; ComponentLink5Description: https://datasheet.ciiva.com/16200/cd00050750-16200026.pdf?src-supplier=Future+Electronics; ComponentLink6URL: https://datasheet.ciiva.com/41444/001184109-da-01-en-ic-esd-protecti-usblc6-2sc6-sot-23-6-stm-41444156.pdf?src-supplier=Conrad; ComponentLink6Description: https://datasheet.ciiva.com/41444/001184109-da-01-en-ic-esd-protecti-usblc6-2sc6-sot-23-6-stm-41444156.pdf?src-supplier=Conrad; Supplier Part Number 1: 497-5235-1-ND
U7 = M41T00M6F: IC RTC CLK/CALENDAR I2C 8-SOIC; Manufacturer: STMicroelectronics; Designed by: Hamit; Logic Function: Clock; Time Format: HH:MM:SS; Max Supply Voltage: 5.5V; Min Supply Voltage: 2V; Non-volatile Memory Size: 8B; Interface: I2C,Serial,2-Wire; Date Format: YY-MM-DD-dd; Supplier 1: Digi-Key; Manufacturer Part Number: M41T00M6F; RoHS: Yes; Category: Memory; Stock 1: 264; Pricing 1: 1=2,95000, 10=2,64900, 25=2,49880, 100=2,12890, 250=1,99896, 500=1,74908, 1000=1,65008 (USD); Mount: Surface Mount; Case/Package: SOIC; Number of Pins: 8; Weight: 0.019048oz; Min Operating Temperature: -40°C; Max Operating Temperature: 85°C; Packaging: Tape and Reel; Package Quantity: 2500; Memory Size: 8B; RAM Size: 8B; Series: M41T00; Supply Voltage-Nom: 5.5V; Length: 5mm; Width: 4mm; Height: 1.5mm; Radiation Hardening: No; REACH SVHC: No SVHC; Lead Free: Lead Free; Temperature Grade: INDUSTRIAL; RoHS Compliant: Yes; ComponentLink1URL: https://datasheet.ciiva.com/25889/cd00001542-25889923.pdf?src-supplier=Avnet+Europe; ComponentLink1Description: https://datasheet.ciiva.com/25889/cd00001542-25889923.pdf?src-supplier=Avnet+Europe; ComponentLink2URL: https://datasheet.ciiva.com/16213/cd00001542-16213654.pdf?src-supplier=Future+Electronics; ComponentLink2Description: https://datasheet.ciiva.com/16213/cd00001542-16213654.pdf?src-supplier=Future+Electronics; ComponentLink3URL: https://datasheet.ciiva.com/7630/1837112-7630077.pdf?src-supplier=Element14; ComponentLink3Description: https://datasheet.ciiva.com/7630/1837112-7630077.pdf?src-supplier=Element14; ComponentLink4URL: https://datasheet.ciiva.com/41459/001185345-da-01-en-ic-rtc-srl-512kbit-m41t00m6f-soic-8-stm-41459818.pdf?src-supplier=Conrad; ComponentLink4Description: https://datasheet.ciiva.com/41459/001185345-da-01-en-ic-rtc-srl-512kbit-m41t00m6f-soic-8-stm-41459818.pdf?src-supplier=Conrad; Supplier Part Number 1: 497-4697-1-ND
X1 = CRYSTAL 16MHZ 20PF SMD: CRYSTAL 16.0000MHZ 20PF SMD; Manufacturer: ECS International; Designed by: Hamit; Frequency Tolerance: 30ppm; ESR (Equivalent Series Resistance): 50R; Frequency Stability: 50ppm; Supplier 1: Digi-Key; Manufacturer Part Number: ECS-160-20-30B-TR; RoHS: Yes; Category: Crystals; Stock 1: 5789; Pricing 1: 1=1,33000, 10=1,26800, 50=1,23900, 100=1,06200, 500=1,03250 (USD); Mount: Surface Mount; Case/Package: SMD/SMT; Min Operating Temperature: -20°C; Max Operating Temperature: 70°C; Package Quantity: 1; Load Capacitance: 20pF; Packaging: Tape and Reel; Tolerance: 50ppm; Termination: SMD/SMT; Series: ECX-53B; Length: 0.197inch; Width: 0.126inch; Height: 0.033inch; Lead Free: Lead Free; RoHS Compliant: Yes; ComponentLink1URL: https://datasheet.ciiva.com/853/ecx-53b-853408.pdf?src-supplier=Digi-Key; ComponentLink1Description: https://datasheet.ciiva.com/853/ecx-53b-853408.pdf?src-supplier=Digi-Key; ComponentLink2URL: https://datasheet.ciiva.com/853/ecx-53b-853406.pdf?src-supplier=Digi-Key; ComponentLink2Description: https://datasheet.ciiva.com/853/ecx-53b-853406.pdf?src-supplier=Digi-Key; ComponentLink3URL: https://datasheet.ciiva.com/853/ecx-53b-853407.pdf?src-supplier=Digi-Key; ComponentLink3Description: https://datasheet.ciiva.com/853/ecx-53b-853407.pdf?src-supplier=Digi-Key; Supplier Part Number 1: XC1120CT-ND
X2 = CRYSTAL 32768kHz: ABRACON - ABS05-32.768KHZ-T - Crystal, 32.768 kHz, SMD, 1.6mm x 1mm, 12.5 pF, 20 ppm, ABS05 Series; Frequency Tolerance: 20ppm; Load Capacitance: 12.5pF; ESR (Equivalent Series Resistance): 90kR; Designed by: Hamit; Supplier 1: Digi-Key; Manufacturer: Abracon; Manufacturer Part Number: ABS05-32.768KHZ-T; RoHS: Yes; Category: Crystals; Pricing 1: 1=1,16000, 10=1,02500, 50=0,95760, 100=0,84630, 500=0,80180, 1000=0,66816 (USD); Mount: Surface Mount; Case/Package: SMD/SMT; Number of Pins: 2; Min Operating Temperature: -40°C; Max Operating Temperature: 85°C; Packaging: Tape and Reel; Package Quantity: 3000; Tolerance: 20ppm; Termination: SMD/SMT; Series Resistance: 90kR; Series: ABS05; Operating Frequency: 32.768 kHz; Length: 1.6mm; Width: 0.039inch; Height: 0.02inch; Depth: 1mm; Radiation Hardening: No; REACH SVHC: No SVHC; Lead Free: Lead Free; RoHS Compliant: Yes; ComponentLink1URL: https://datasheet.ciiva.com/23810/abs05-23810480.pdf?src-supplier=Newark; ComponentLink1Description: https://datasheet.ciiva.com/23810/abs05-23810480.pdf?src-supplier=Newark; ComponentLink2URL: https://datasheet.ciiva.com/6728/abs05-6728949.pdf?src-supplier=Digi-Key; ComponentLink2Description: https://datasheet.ciiva.com/6728/abs05-6728949.pdf?src-supplier=Digi-Key; ComponentLink3URL: https://datasheet.ciiva.com/6728/abs05-6728950.pdf?src-supplier=Digi-Key; ComponentLink3Description: https://datasheet.ciiva.com/6728/abs05-6728950.pdf?src-supplier=Digi-Key; ComponentLink4URL: https://datasheet.ciiva.com/16411/abs05-16411149.pdf?src-supplier=Future+Electronics; ComponentLink4Description: https://datasheet.ciiva.com/16411/abs05-16411149.pdf?src-supplier=Future+Electronics; Supplier Part Number 1: 535-11899-1-ND